# EAGLE design LoRa1278_Breakout (EAGLE 7.3.0)
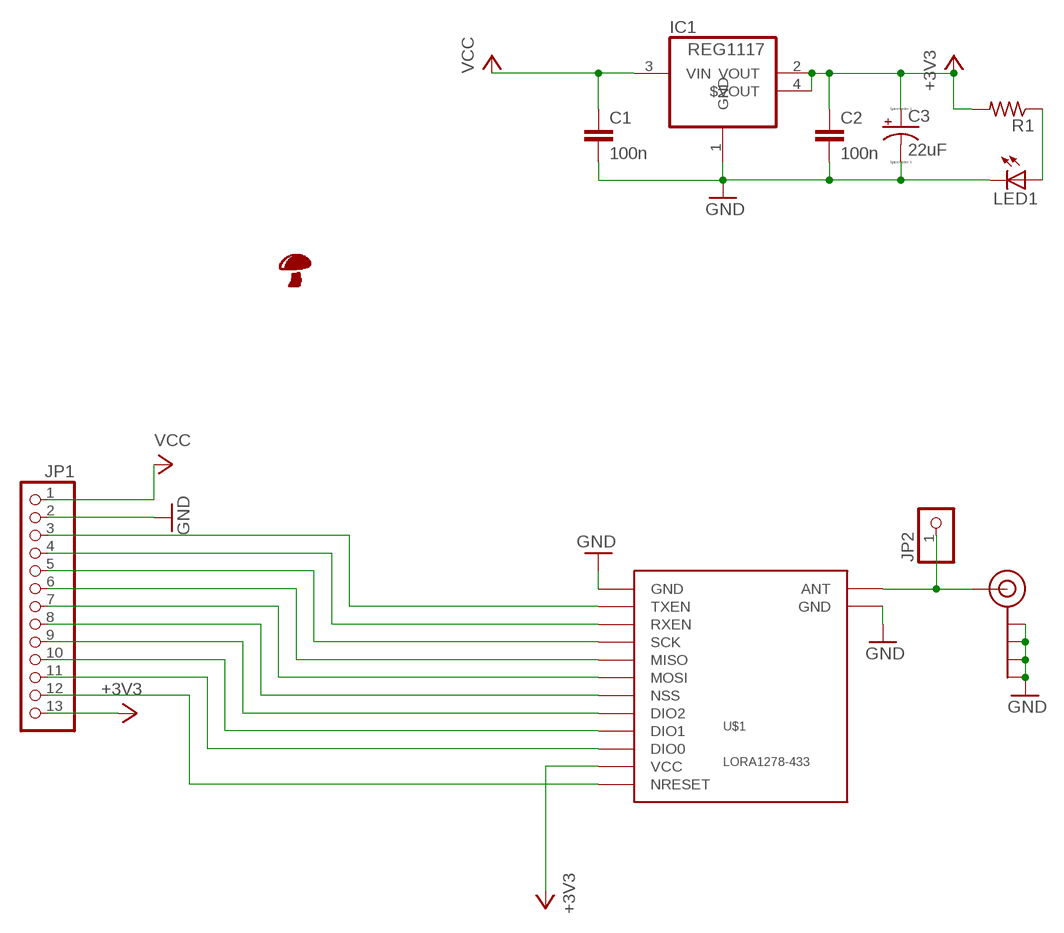
[diagram p0: schematic, sheet 1]

## Parts
C1  100n  C-EUC0805  [C0805]
C2  100n  C-EUC0805  [C0805]
C3  22uF  CPOL-USC  [PANASONIC_C]
IC1  REG1117  [SOT223]
J$1  SMA_EDGE  [SMA-EDGE]
JP1  PINHD-1X13  [1X13]
JP2  PINHD-1X1  [1X01]
LED1  LEDCHIP-LED0805  [CHIP-LED0805]
R1  R-US_R0805  [R0805]
U$1  LORA1278-433  [LORA1278]
U$2  SHROOM5MM  [SHROOM]

## Nets
+3V3: C2.1 C3.+ IC1.2(VOUT) IC1.4($VOUT) JP1.13 R1.2 U$1.P$11(VCC)
GND: C1.2 C2.2 C3.- IC1.1(GND) J$1.GND@0(GND) J$1.GND@1(GND) J$1.GND@2(GND) J$1.GND@3(GND) JP1.2 LED1.C U$1.P$1(GND) U$1.P$14(GND)
N$1: JP1.3 U$1.P$2(TXEN)
N$2: JP1.4 U$1.P$3(RXEN)
N$3: JP1.5 U$1.P$4(SCK)
N$4: JP1.6 U$1.P$5(MISO)
N$5: JP1.7 U$1.P$6(MOSI)
N$6: JP1.8 U$1.P$7(NSS)
N$7: JP1.9 U$1.P$8(DIO2)
N$8: JP1.10 U$1.P$9(DIO1)
N$9: JP1.11 U$1.P$10(DIO0)
N$10: JP1.12 U$1.P$12(NRESET)
N$11: J$1.SIG(SIGNAL) JP2.1 U$1.P$13(ANT)
N$12: LED1.A R1.1
VCC: C1.1 IC1.3(VIN) JP1.1

## Library data of the parts
C1 C2 = resistor:C-EU: CAPACITOR, European symbol
C3 = resistor:CPOL-US: POLARIZED CAPACITOR, American symbol
IC1 = burr-brown:REG1117: 800mA and 1A Low Dropout (LDO) Positive Regulator 1.8V, 2.5V, 2.85V, 3.3V, 5V, and Adj; MPN: REG1117; OC_FARNELL: 1097566; OC_NEWARK: 14P6981
J$1 = SparkFun-Connectors:SMA_EDGE: SMA Antenna Connector End launch SMA connector. The paste layer has been removed so that the connector can be hand soldered onto the board after reflow.
JP1 = pinhead:PINHD-1X13: PIN HEADER
JP2 = pinhead:PINHD-1X1: PIN HEADER
LED1 = led:LED: LED OSRAM: - CHIPLED LG R971, LG N971, LY N971, LG Q971, LY Q971, LO R971, LY R971 LH N974, LH R974 LS Q976, LO Q976, LY Q976 LO Q996 - Hyper CHIPLED LW Q18S LB Q993, LB Q99A, LB R99A - SideLED LS A670, LO A670, LY A670, LG A670, LP A670 LB A673, LV A673, LT A673, LW A673 LH A674 LY A675 LS A676, LA A676, LO A676, LY A676, LW A676 LS A679, LY A679, LG A679 - Hyper Micro SIDELED® LS Y876, LA Y876, LO Y876, LY Y876 LT Y87S - SmartLED LW L88C, LW L88S LB L89C, LB L89S, LG L890 LS L89K, LO L89K, LY L89K LS L896, LA L896, LO L896, LY L896 - TOPLED LS T670, LO T670, LY T670, LG T670, LP T670 LSG T670, LSP T670, LSY T670, LOP T670, LYG T670 LG T671, LOG T671, LSG T671 LB T673, LV T673, LT T673, LW T673 LH T674 LS T676, LA T676, LO T676, LY T676, LB T676, LH T676, LSB T676, LW T676 LB T67C, LV T67C, LT T67C, LS T67K, LO T67K, LY T67K, LW E67C LS E67B, LA E67B, LO E67B, LY E67B, LB E67C, LV E67C, LT E67C LW T67C LS T679, LY T679, LG T679 LS T770, LO T770, LY T770, LG T770, LP T770 LB T773, LV T773, LT T773, LW T773 LH T774 LS E675, LA E675, LY E675, LS T675 LS T776, LA T776, LO T776, LY T776, LB T776 LHGB T686 LT T68C, LB T68C - Hyper Mini TOPLED® LB M676 - Mini TOPLED Santana® LG M470 LS M47K, LO M47K, LY M47K Source: http://www.osram.convergy.de LUXEON: - LUMILED® LXK2-PW12-R00, LXK2-PW12-S00, LXK2-PW14-U00, LXK2-PW14-V00 LXK2-PM12-R00, LXK2-PM12-S00, LXK2-PM14-U00 LXK2-PE12-Q00, LXK2-PE12-R00, LXK2-PE12-S00, LXK2-PE14-T00, LXK2-PE14-U00 LXK2-PB12-K00, LXK2-PB12-L00, LXK2-PB12-M00, LXK2-PB14-N00, LXK2-PB14-P00, LXK2-PB14-Q00 LXK2-PR12-L00, LXK2-PR12-M00, LXK2-PR14-Q00, LXK2-PR14-R00 LXK2-PD12-Q00, LXK2-PD12-R00, LXK2-PD12-S00 LXK2-PH12-R00, LXK2-PH12-S00 LXK2-PL12-P00, LXK2-PL12-Q00, LXK2-PL12-R00 Source: www.luxeon.com KINGBRIGHT: KA-3528ASYC Source: www.kingbright.com
R1 = resistor:R-US_: RESISTOR, American symbol
U$1 = NiceRF:LORA1278-433: NiceRF LoRa1278 Module
U$2 = RobThePyro:SHROOM

## Board
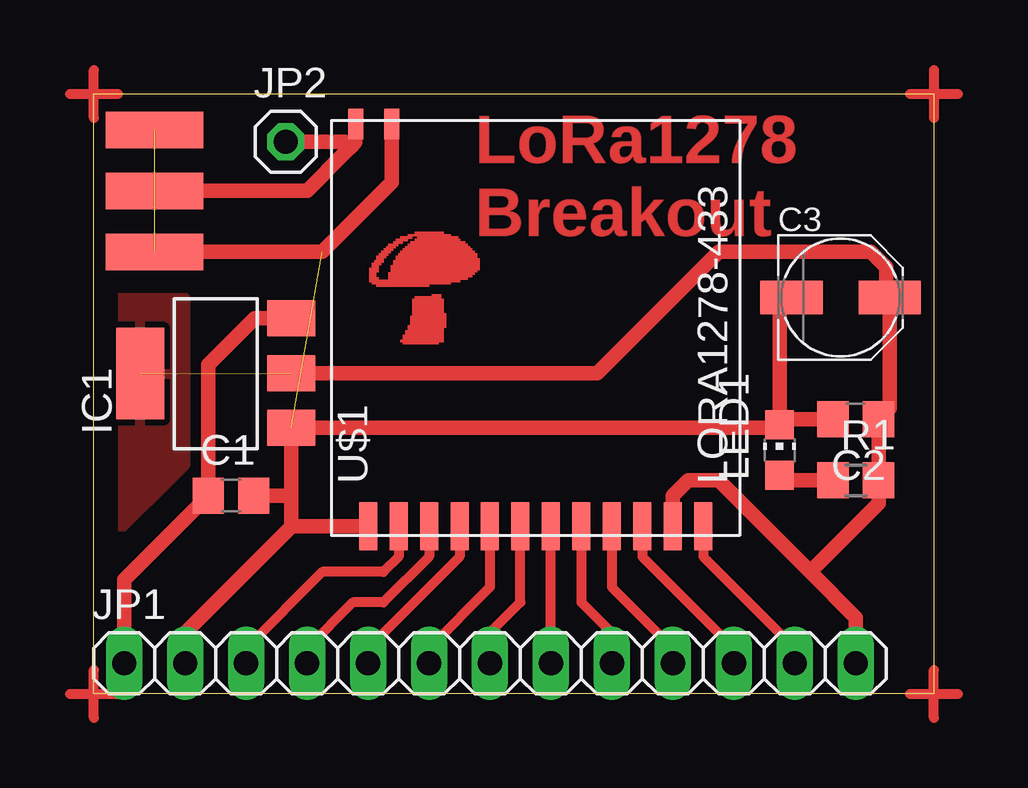
[diagram p1: board, top side]
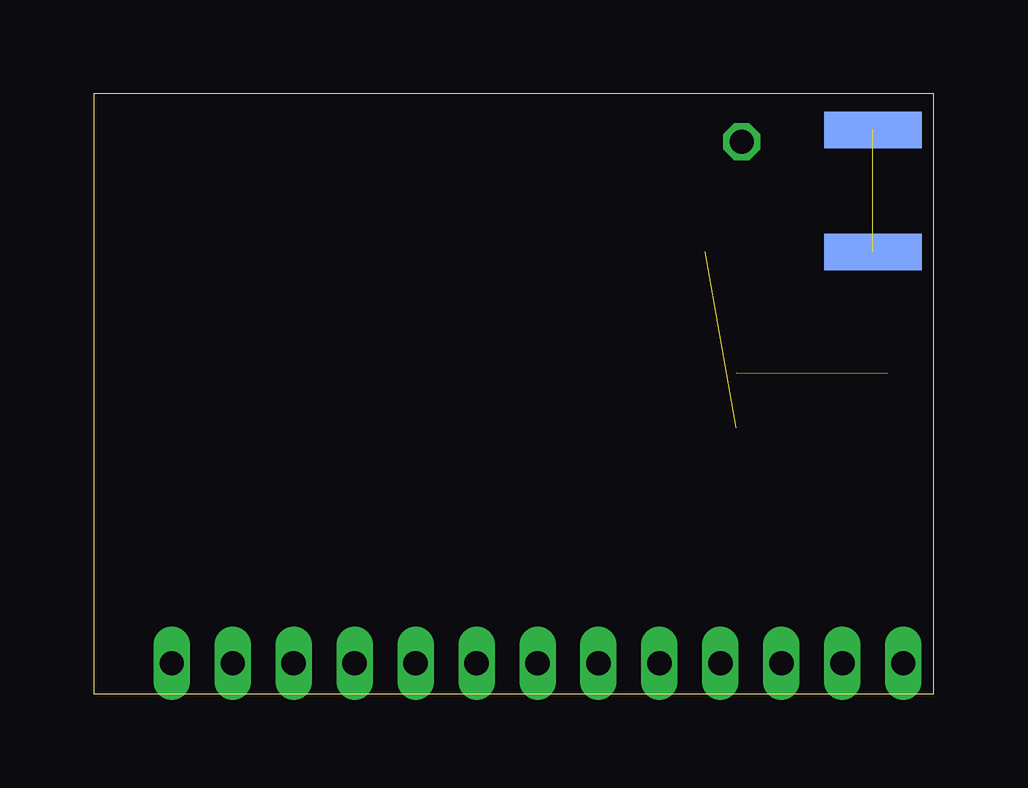
[diagram p2: board, bottom side, seen from below]

Size 35 x 25 mm. Coordinates in mm from the lower left corner, seen from the top.
Outline: 0,0 0,25 35,25 35,0 0,0
Copper layers (1*16): Top 0.035mm / dielectric 1.5mm / Bottom 0.035mm
Design rules "default": minimum track width 10mil, minimum drill 24mil, track to track 8mil, track to pad 8mil, pad to pad 8mil, via to via 8mil, smd to smd 8mil, copper to edge 40mil, drill to drill 8mil, minimum pad ring 10mil, minimum via ring 8mil, stop-mask expansion 4mil, vias tented up to drill 0mil, thermal gap 10mil

### Footprints (pad centres in the part's own frame; a part is rotated, then mirrored left to right if it is on the bottom)
C0805 = smd 1.3 x 1.5: 1 -0.95,0; 2 0.95,0
PANASONIC_C = smd 2.6 x 1.4: + 2.05,0; - -2.05,0
SOT223 = smd 1.499 x 2.007: 1 -2.261,-3.15; 2 0.025,-3.15; 3 2.311,-3.15 | smd 3.81 x 2.007: 4 0,3.15
SMA-EDGE = smd 1.524 x 4.064: GND@0 0,0; GND@1 5.08,0; SIG 2.54,0 | smd 1.524 x 4.064 bottom: GND@2 0,0; GND@3 5.08,0
1X13 = drill 1.016 long: 1 -15.24,0; 2 -12.7,0; 3 -10.16,0; 4 -7.62,0; 5 -5.08,0; 6 -2.54,0; 7 0,0; 8 2.54,0; 9 5.08,0; 10 7.62,0; 11 10.16,0; 12 12.7,0; 13 15.24,0
1X01 = drill 1.016 octagon: 1 0,0
CHIP-LED0805 = smd 1.2 x 1.2: A 0,-1.05; C 0,1.05
R0805 = smd 1.3 x 1.5: 1 -0.95,0; 2 0.95,0
LORA1278 = smd 2 x 0.75: P$1 -8.255,6.985; P$2 -8.255,5.715; P$3 -8.255,4.445; P$4 -8.255,3.175; P$5 -8.255,1.905; P$6 -8.255,0.635; P$7 -8.255,-0.635; P$8 -8.255,-1.905; P$9 -8.255,-3.175; P$10 -8.255,-4.445; P$11 -8.255,-5.715; P$12 -8.255,-6.985 | smd 1.27 x 0.635: P$13 8.5,7.5; P$14 8.5,6

### Placement (x,y rotation side)
C1  5.71,8.26 0 top
C2  31.75,11.43 180 top
C3  31.11,16.51 0 top
IC1  5.08,13.34 90 top
J$1  2.54,23.5 270 top
JP1  16.51,1.27 0 top
JP2  8,23 0 top
LED1  28.57,10.16 0 top
R1  31.75,8.89 0 top
U$1  18.41,15.24 90 top
U$2  11.43,14.61 0 top

### Tracks (layer width: path | path; a pad name or v marks a point on that pad's centre or on a via)
+3V3  (1 unrouted)
  Top 0.61: U$1.P$11 24.13,8.26 24.77,8.89 26.04,8.89 29.84,5.08 | 29.84,5.08 31.75,3.17 JP1.13 | IC1.2 20.98,13.36 26.04,18.41 32.38,18.41 33.02,17.78 33.02,16.66 C3.+ 33.16,11.89 C2.1 R1.2 32.7,7.93 29.84,5.08
  pour Top: 0.64,6.35 0.64,16.51 3.81,16.51 3.81,9.53
GND  (4 unrouted)
  Top 0.61: U$1.P$1 8.26,6.99 | 8.26,6.99 3.81,2.54 JP1.2 | 8.23,8.26 IC1.1 28.44,11.07 LED1.C | 8.23,8.26 8.23,7.01 8.26,6.99 | C1.2 8.23,8.26 | U$1.P$14 12.41,21.3 9.53,18.41 J$1.GND@3 | LED1.C 28.57,16.02 C3.- | C2.2 28.8,11.43 LED1.C
N$1
  Top 0.406: U$1.P$2 12.7,5.71 12.06,5.08 9.53,5.08 6.35,1.91 JP1.3
N$2
  Top 0.406: U$1.P$3 13.97,5.71 12.06,3.81 10.79,3.81 8.89,1.91 JP1.4
N$3
  Top 0.406: U$1.P$4 15.24,5.71 11.43,1.91 JP1.5
N$4
  Top 0.406: U$1.P$5 16.51,4.45 13.97,1.91 JP1.6
N$5
  Top 0.406: JP1.7 16.51,2.54 17.78,3.81 U$1.P$6
N$6
  Top 0.406: JP1.8 U$1.P$7
N$7
  Top 0.406: U$1.P$8 20.32,3.81 21.59,2.54 JP1.9
N$8
  Top 0.406: U$1.P$9 21.59,4.45 24.13,1.91 JP1.10
N$9
  Top 0.406: U$1.P$10 22.86,5.71 26.67,1.91 JP1.11
N$10
  Top 0.406: U$1.P$12 25.4,5.71 29.21,1.91 JP1.12
N$11
  Top 0.61: J$1.SIG 8.89,20.95 10.47,22.53 | 10.47,22.53 10.79,22.86 10.79,22.89 10.9,22.99 10.9,23.72 U$1.P$13 | JP2.1 10.47,23 10.47,22.53
N$12
  Top 0.61: R1.1 28.8,8.89 LED1.A
N$13
  Top 0.406: 0,24 0,26
N$14
  Top 0.406: -1,25 1,25
N$15
  Top 0.406: 34,25 36,25
N$16
  Top 0.406: 35,26 35,24
N$17
  Top 0.406: 34,0 36,0
N$18
  Top 0.406: 35,-1 35,1
N$19
  Top 0.406: 0,-1 0,1
N$20
  Top 0.406: -1,0 1,0
VCC
  Top 0.61: JP1.1 1.27,4.76 C1.1 4.76,13.71 6.71,15.65 IC1.3

### Text on the board
Top: LoRa1278 / Breakout